# EAGLE schematic Overall (EAGLE 8.6.0)
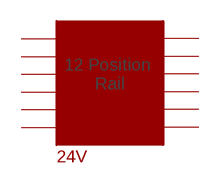
[diagram p0: schematic, sheet 1]

## Parts
U$2  24V  12-POSITION-RAIL  (no package)
Unconnected: U$2.P$1 U$2.P$2 U$2.P$3 U$2.P$4 U$2.P$5 U$2.P$6 U$2.P$7 U$2.P$8 U$2.P$9 U$2.P$10 U$2.P$11 U$2.P$12

## Library data of the parts
U$2 = Overall:12-POSITION-RAIL